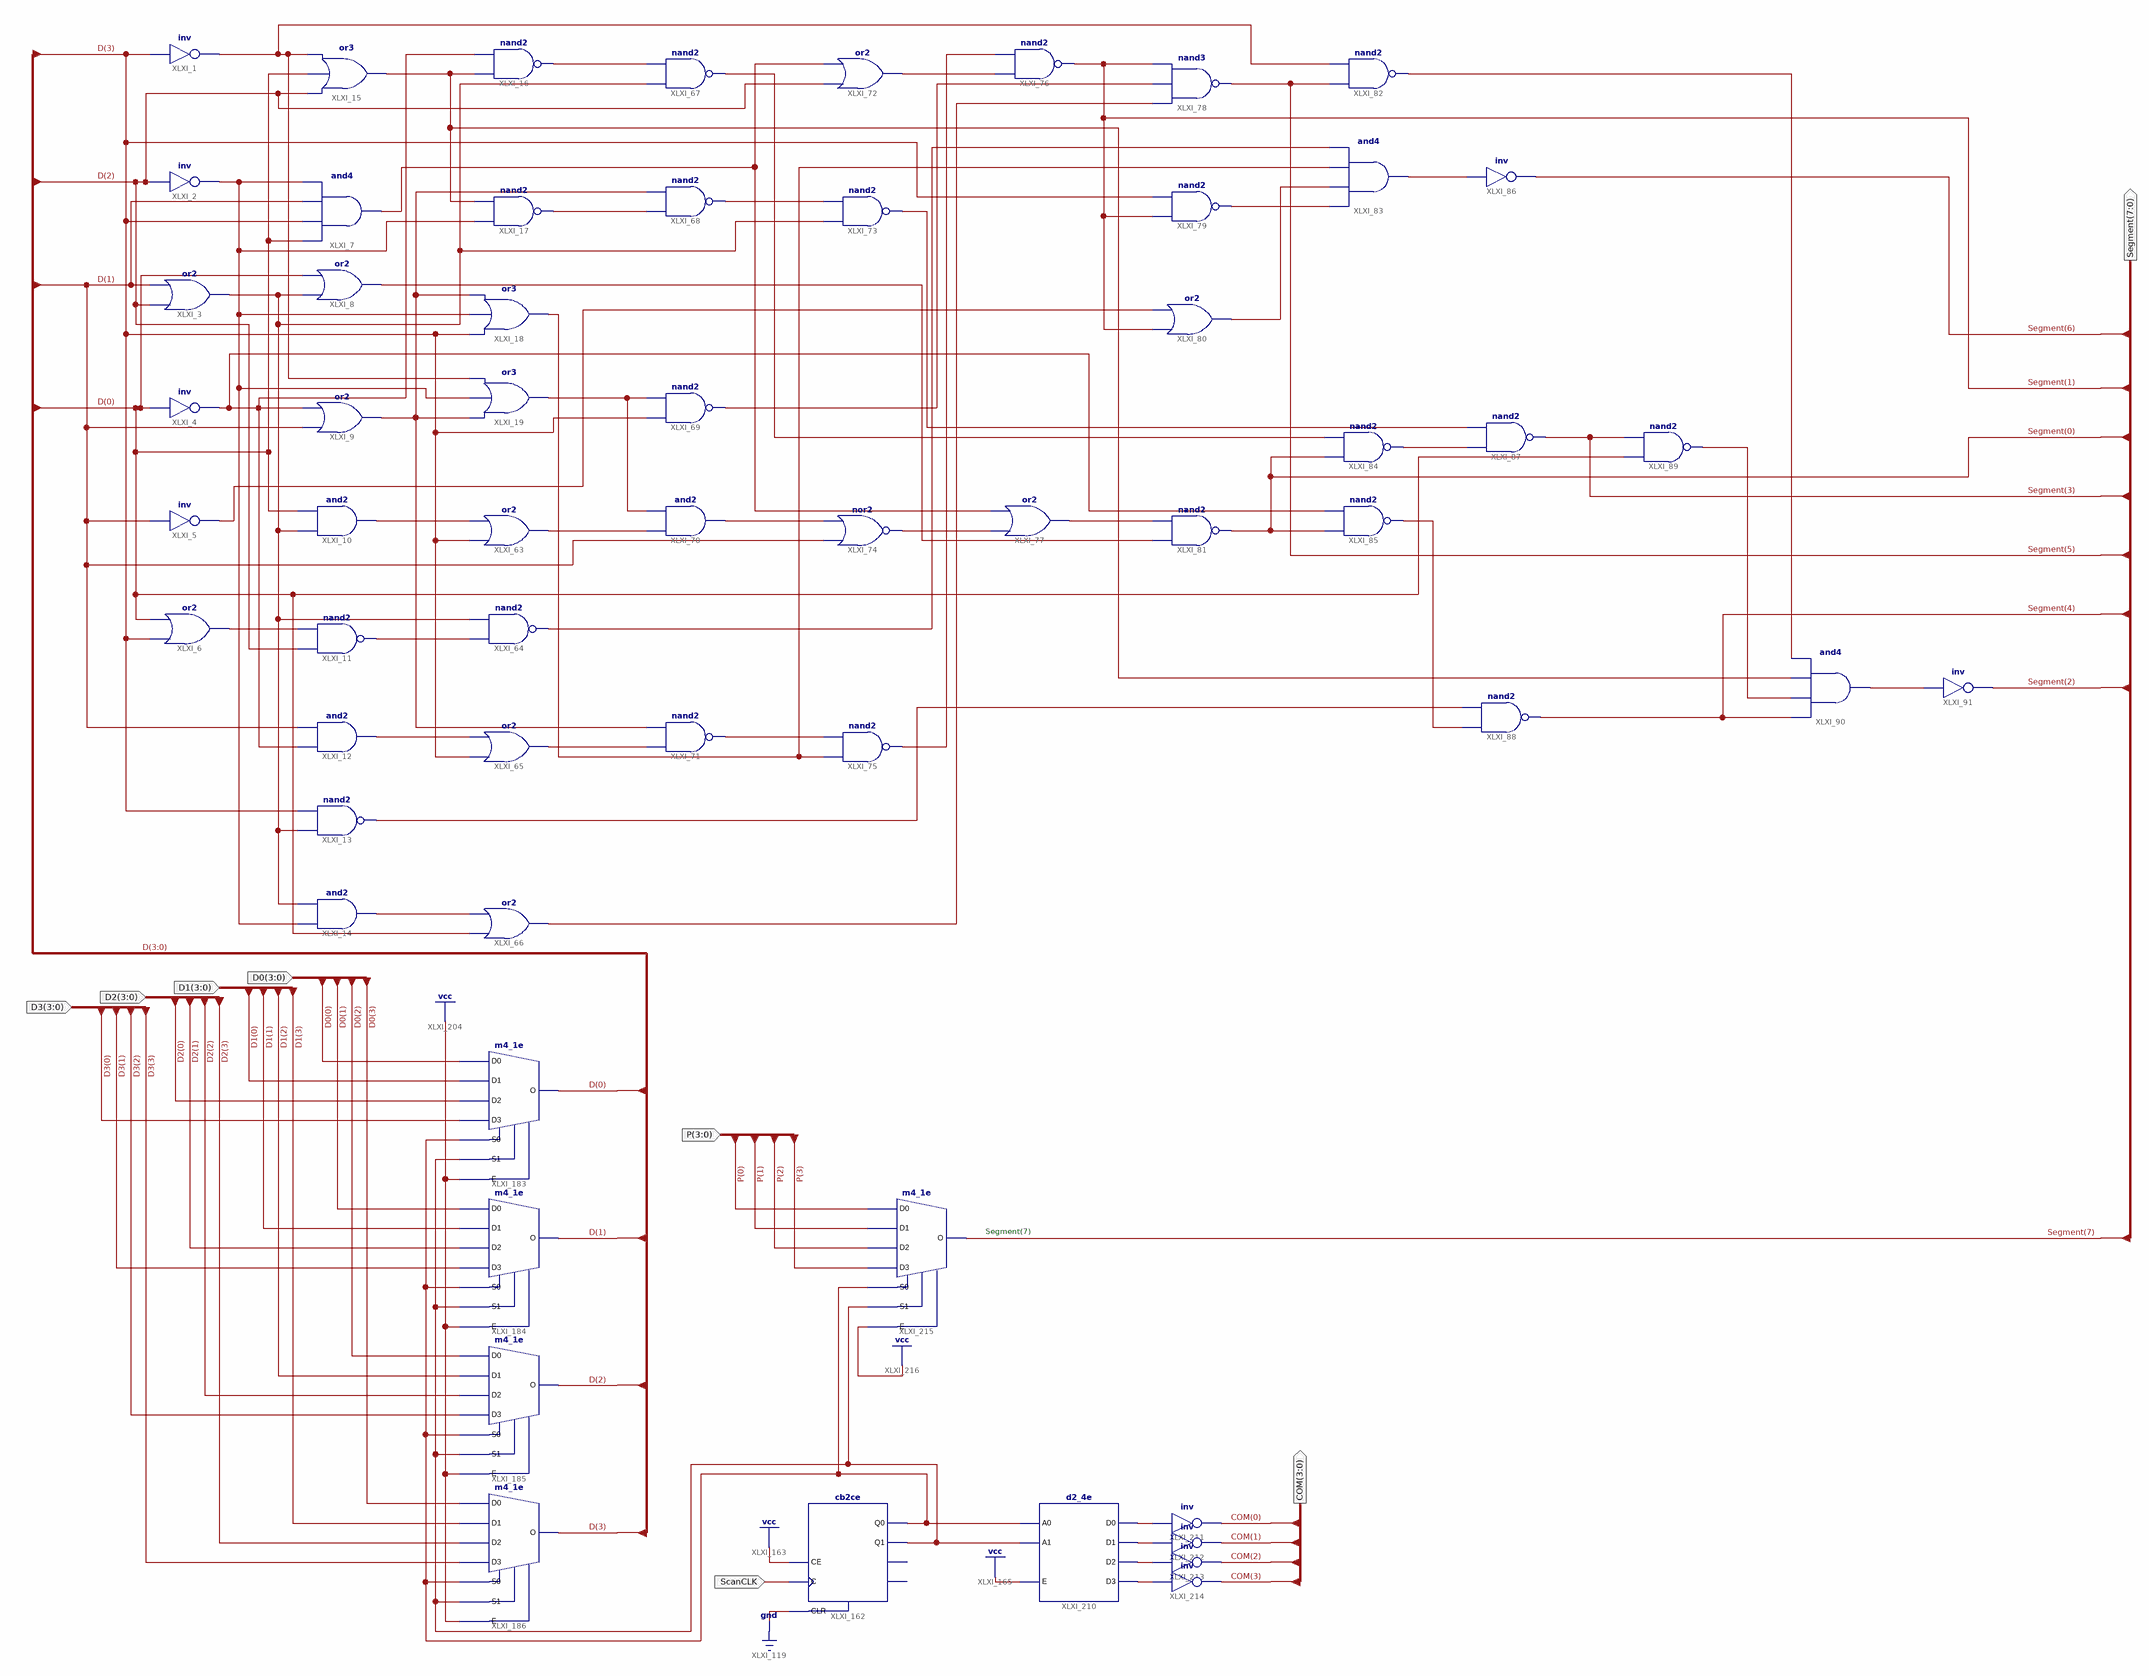
[diagram p0: schematic sheet 1]
// Xilinx ISE schematic ssd4d0fpb.sch (spartan6) as structural Verilog: 59 symbols, 8 ports
module ssd4d0fpb (
  input  [3:0] D0,
  input  [3:0] D1,
  input  [3:0] D2,
  input  [3:0] D3,
  input  ScanCLK,
  input  [3:0] P,
  output [7:0] Segment,
  output [3:0] COM
);

  wire XLXN_7, XLXN_9, XLXN_10, XLXN_11, XLXN_12, XLXN_13, XLXN_14, XLXN_15, XLXN_16, XLXN_17, XLXN_18,
       XLXN_20, XLXN_21, XLXN_22, XLXN_23, XLXN_25, XLXN_26, XLXN_29, XLXN_30, XLXN_31, XLXN_32, XLXN_33,
       XLXN_34, XLXN_36, XLXN_38, XLXN_39, XLXN_40, XLXN_41, XLXN_42, XLXN_44, XLXN_45, XLXN_46, XLXN_47,
       XLXN_48, XLXN_50, XLXN_51, XLXN_52, XLXN_65, XLXN_84, XLXN_90, XLXN_91, XLXN_195, XLXN_199, XLXN_236,
       XLXN_237, XLXN_238, XLXN_239;
  wire [3:0] D;

  not XLXI_1 (XLXN_12, D[3]);
  not XLXI_2 (XLXN_10, D[2]);
  or XLXI_3 (XLXN_29, D[2], D[1]);
  not XLXI_4 (XLXN_9, D[0]);
  not XLXI_5 (XLXN_39, D[1]);
  or XLXI_6 (XLXN_7, D[3], D[0]);
  and XLXI_7 (XLXN_25, D[0], D[3], D[1], XLXN_10);
  or XLXI_8 (XLXN_42, XLXN_29, D[0]);
  or XLXI_9 (XLXN_20, D[1], XLXN_9);
  and XLXI_10 (XLXN_13, XLXN_29, D[0]);
  nand XLXI_11 (XLXN_14, D[2], XLXN_7);
  and XLXI_12 (XLXN_15, XLXN_9, D[1]);
  nand XLXI_13 (XLXN_50, XLXN_29, D[3]);
  and XLXI_14 (XLXN_16, XLXN_10, XLXN_29);
  or XLXI_15 (XLXN_11, D[2], D[0], XLXN_12);
  nand XLXI_16 (XLXN_17, XLXN_11, XLXN_9);
  nand XLXI_17 (XLXN_18, XLXN_10, XLXN_11);
  or XLXI_18 (XLXN_44, D[3], XLXN_10, XLXN_20);
  or XLXI_19 (XLXN_22, XLXN_20, XLXN_10, XLXN_12);
  or XLXI_63 (XLXN_21, D[3], XLXN_13);
  nand XLXI_64 (XLXN_45, XLXN_14, XLXN_29);
  or XLXI_65 (XLXN_23, D[3], XLXN_15);
  or XLXI_66 (XLXN_38, D[0], XLXN_16);
  nand XLXI_67 (XLXN_46, XLXN_29, XLXN_17);
  nand XLXI_68 (XLXN_26, XLXN_18, XLXN_20);
  nand XLXI_69 (XLXN_36, D[3], XLXN_22);
  and XLXI_70 (XLXN_30, XLXN_21, XLXN_22);
  nand XLXI_71 (XLXN_31, XLXN_23, XLXN_20);
  or XLXI_72 (XLXN_33, D[2], XLXN_25);
  nand XLXI_73 (XLXN_84, XLXN_29, XLXN_26);
  nor XLXI_74 (XLXN_32, D[1], XLXN_30);
  nand XLXI_75 (XLXN_34, XLXN_44, XLXN_31);
  nand XLXI_76 (Segment[1], XLXN_33, XLXN_34);
  or XLXI_77 (XLXN_65, XLXN_32, XLXN_25);
  nand XLXI_78 (Segment[5], XLXN_38, XLXN_36, Segment[1]);
  nand XLXI_79 (XLXN_40, Segment[1], D[3]);
  or XLXI_80 (XLXN_41, Segment[1], XLXN_39);
  nand XLXI_81 (Segment[0], XLXN_42, XLXN_65);
  nand XLXI_82 (XLXN_90, Segment[5], XLXN_12);
  and XLXI_83 (XLXN_47, XLXN_40, XLXN_41, XLXN_44, XLXN_45);
  nand XLXI_84 (XLXN_48, Segment[0], XLXN_46);
  nand XLXI_85 (XLXN_51, Segment[0], XLXN_9);
  nand XLXI_87 (Segment[3], XLXN_48, XLXN_84);
  not XLXI_86 (Segment[6], XLXN_47);
  nand XLXI_88 (Segment[4], XLXN_51, XLXN_50);
  nand XLXI_89 (XLXN_52, D[0], Segment[3]);
  and XLXI_90 (XLXN_91, Segment[4], XLXN_52, XLXN_11, XLXN_90);
  not XLXI_91 (Segment[2], XLXN_91);
  m4_1e XLXI_183 (.D0(D0[0]), .D1(D1[0]), .D2(D2[0]), .D3(D3[0]), .E(1'b1), .S0(XLXN_195), .S1(XLXN_199), .O(D[0]));
  m4_1e XLXI_184 (.D0(D0[1]), .D1(D1[1]), .D2(D2[1]), .D3(D3[1]), .E(1'b1), .S0(XLXN_195), .S1(XLXN_199), .O(D[1]));
  m4_1e XLXI_185 (.D0(D0[2]), .D1(D1[2]), .D2(D2[2]), .D3(D3[2]), .E(1'b1), .S0(XLXN_195), .S1(XLXN_199), .O(D[2]));
  m4_1e XLXI_186 (.D0(D0[3]), .D1(D1[3]), .D2(D2[3]), .D3(D3[3]), .E(1'b1), .S0(XLXN_195), .S1(XLXN_199), .O(D[3]));
  cb2ce XLXI_162 (.C(ScanCLK), .CE(1'b1), .CLR(1'b0), .Q0(XLXN_195), .Q1(XLXN_199));  // open: CEO, TC
  d2_4e XLXI_210 (.A0(XLXN_195), .A1(XLXN_199), .E(1'b1), .D0(XLXN_236), .D1(XLXN_237), .D2(XLXN_238), .D3(XLXN_239));
  not XLXI_211 (COM[0], XLXN_236);
  not XLXI_212 (COM[1], XLXN_237);
  not XLXI_213 (COM[2], XLXN_238);
  not XLXI_214 (COM[3], XLXN_239);
  m4_1e XLXI_215 (.D0(P[0]), .D1(P[1]), .D2(P[2]), .D3(P[3]), .E(1'b1), .S0(XLXN_195), .S1(XLXN_199), .O(Segment[7]));

  // Notes on the sheet:
  //   Segment(7)
endmodule
